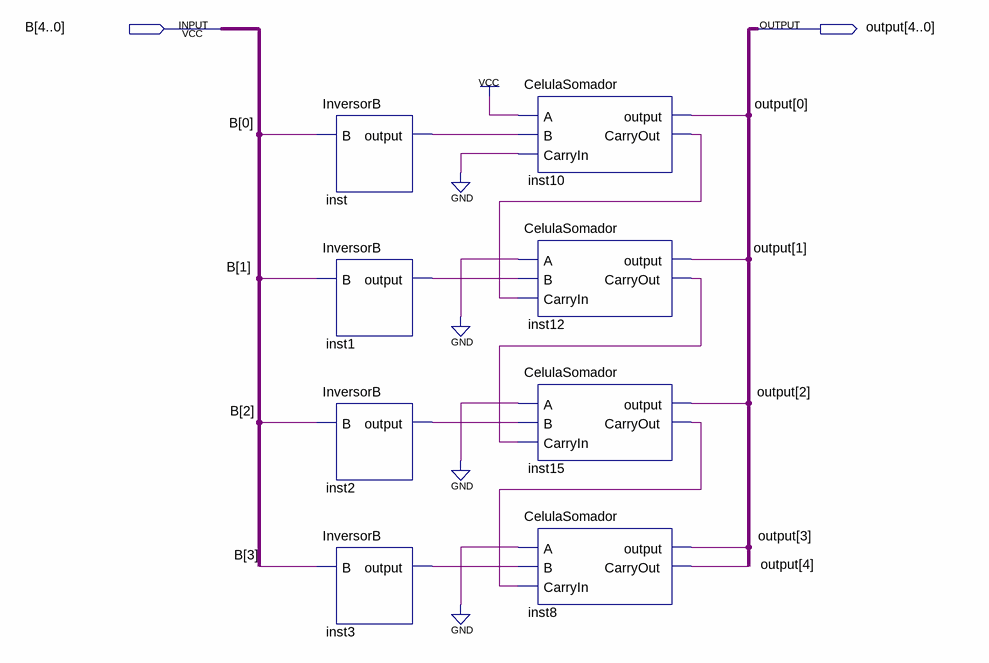
[diagram p0: schematic sheet]
// Quartus schematic ComplementoDeDois.bdf as structural Verilog: 8 symbols, 2 pins
module ComplementoDeDois (
  input  [4:0] B,
  output [4:0] \output 
);

  wire inst1_output, inst2_output, inst3_output, inst10_carryout, inst12_carryout, inst15_carryout,
       inst_output;

  InversorB inst (.B(B[0]), .\output (inst_output));
  InversorB inst1 (.B(B[1]), .\output (inst1_output));
  InversorB inst2 (.B(B[2]), .\output (inst2_output));
  InversorB inst3 (.B(B[3]), .\output (inst3_output));
  CelulaSomador inst10 (.A(1'b1), .B(inst_output), .CarryIn(1'b0), .\output (\output [0]), .CarryOut(inst10_carryout));
  CelulaSomador inst12 (
    .A(1'b0), .B(inst1_output), .CarryIn(inst10_carryout), .\output (\output [1]), .CarryOut(inst12_carryout));
  CelulaSomador inst15 (
    .A(1'b0), .B(inst2_output), .CarryIn(inst12_carryout), .\output (\output [2]), .CarryOut(inst15_carryout));
  CelulaSomador inst8 (
    .A(1'b0), .B(inst3_output), .CarryIn(inst15_carryout), .\output (\output [3]), .CarryOut(\output [4]));
endmodule
